# EasyEDA schematic SCH_ethan-stick_2025-04-03.json
TITLE: Sheet_1; REV: 1.0; Date: 2025-03-31; Sheet: 1/1; Company: Your Company
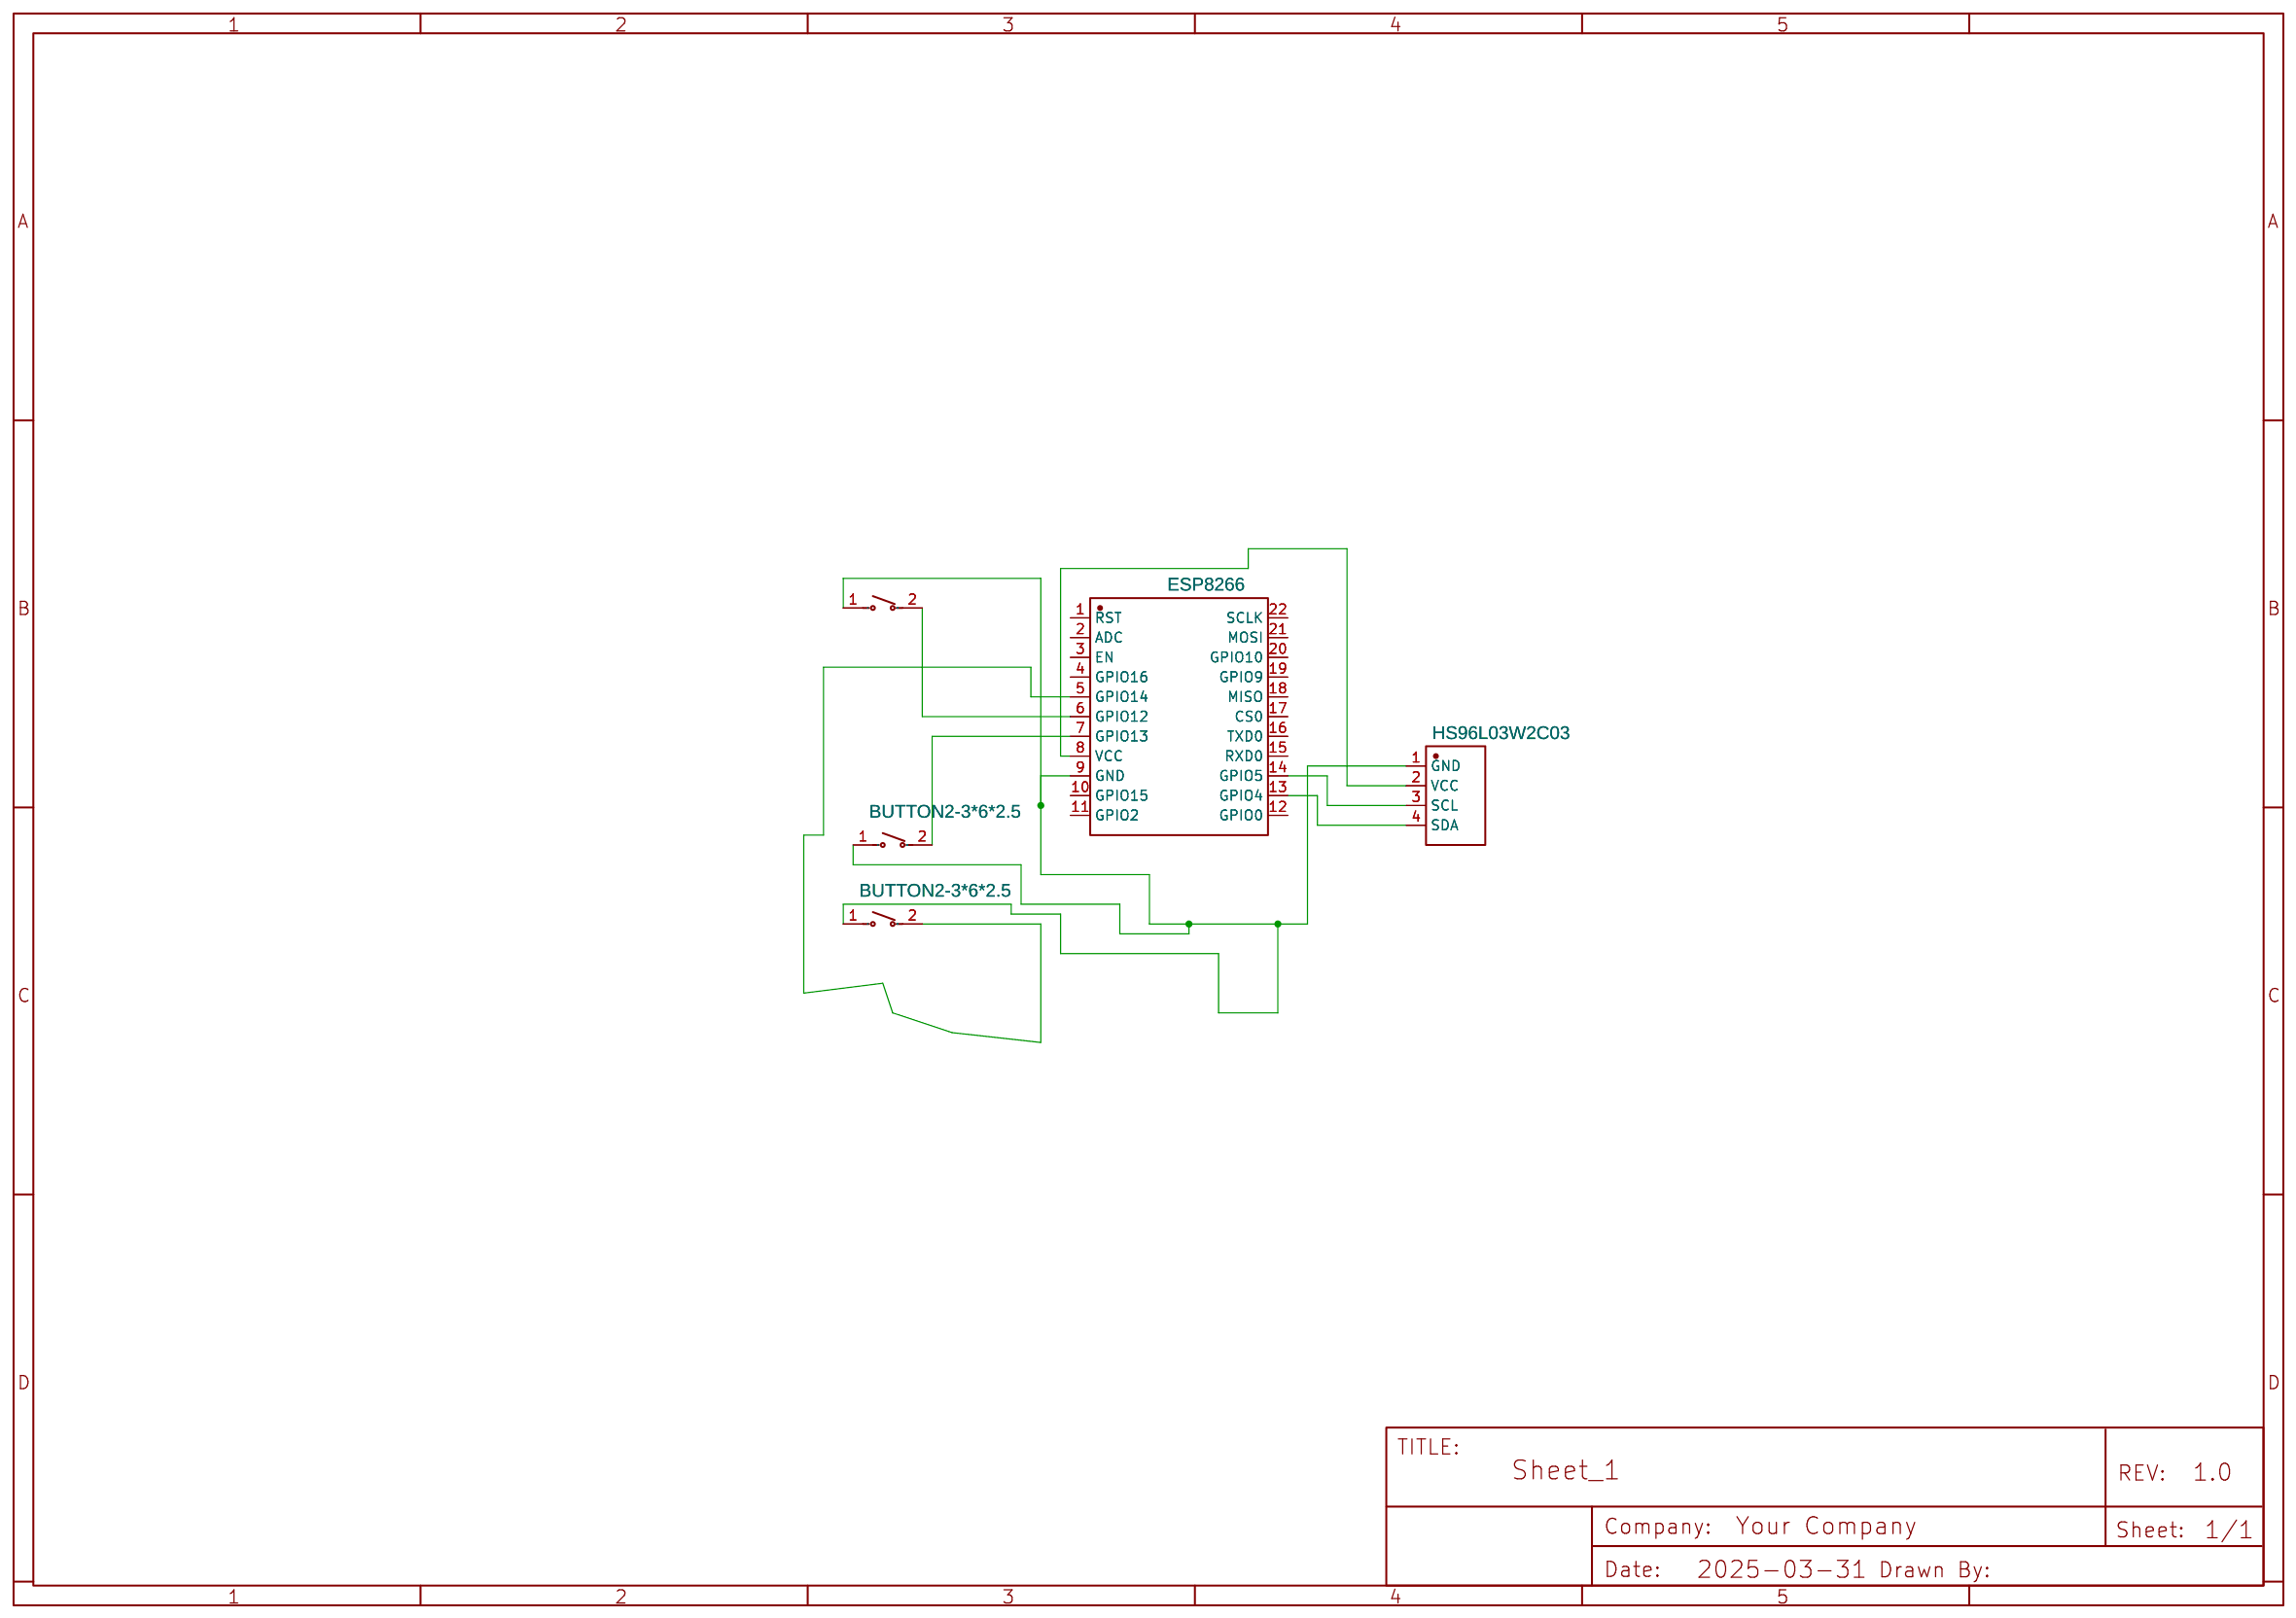
[diagram p0: schematic sheet]

## Parts
KEY1  BUTTON2-3*6*2.5  [SW-SMD_L6.0-W3.7-LS8.0]
KEY2  BUTTON2-3*6*2.5  [SW-SMD_L6.0-W3.7-LS8.0]
KEY3  BUTTON2-3*6*2.5  [SW-SMD_L6.0-W3.7-LS8.0]
U1  ESP8266  [WIFIM-SMD_ESP-12F-ESP8266MOD]
U2  HS96L03W2C03  [OLED-TH_L27.8-W27.2-P2.54_C9900033791]

## Library data of the parts
KEY1-KEY3 = BUTTON2-3*6*2.5: Contributor: LCSC; Supplier: LCSC; Supplier Part: C9900009018; Manufacturer: null; JLCPCB Part Class: Extended Part
U1 = ESP8266: LINK: https://img.jlc.com/image//data/smt-stock-produce/componentSizePhoto/2021-12-02/b5eb61357b2a478295008aee8c894ebd/BG2111290693_D21112900056_font.png; Contributor: LCSC; Supplier: LCSC; Supplier Part: C9900003049; Manufacturer: null
U2 = HS96L03W2C03: Contributor: lcsc; Supplier: LCSC; Supplier Part: C5248080; Manufacturer: HS(汉昇); JLCPCB Part Class: Extended Part

## Nets
Net-(KEY1-1): KEY1.1 KEY2.1 KEY3.1 U1.9(GND) U2.1(GND)
Net-(KEY1-2): KEY1.2 U1.6(GPIO12)
Net-(KEY2-2): KEY2.2 U1.7(GPIO13)
Net-(KEY3-2): KEY3.2 U1.5(GPIO14)
Net-(U1-8): U1.8(VCC) U2.2(VCC)
Net-(U1-13): U1.13(GPIO4) U2.4(SDA)
Net-(U1-14): U1.14(GPIO5) U2.3(SCL)

Not connected (* = marked no-connect by the designer): U1 1(RST) 2(ADC) 3(EN) 4(GPIO16) 10(GPIO15) 11(GPIO2) 12(GPIO0) 15(RXD0) 16(TXD0) 17(CS0) 18(MISO) 19(GPIO9) 20(GPIO10) 21(MOSI) 22(SCLK)
